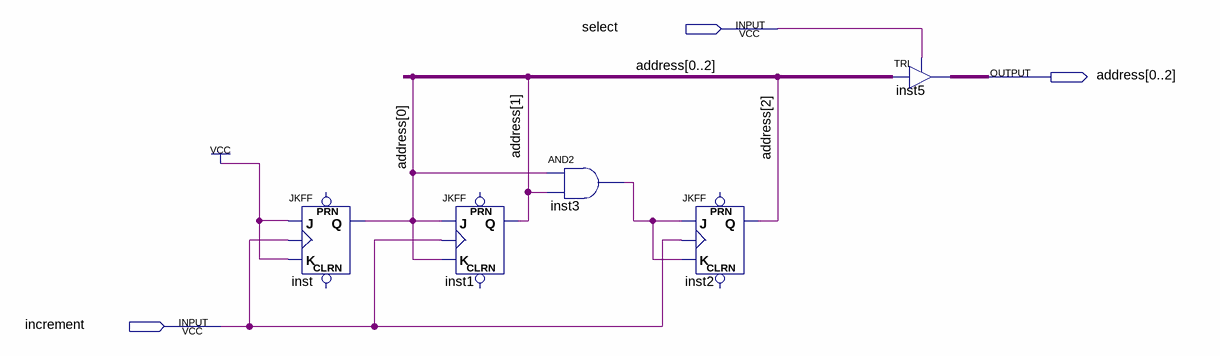
[diagram p0: schematic sheet]
// Quartus schematic instruction_pointer.bdf as structural Verilog: 5 symbols, 3 pins
module instruction_pointer (
  input  select,
  input  increment,
  output [0:2] address
);

  wire inst3_out;

  JKFF inst (.K(1'b1), .J(1'b1), .CLK(increment), .Q(address[0]));  // open: PRN, CLRN
  JKFF inst1 (.K(address[0]), .J(address[0]), .CLK(increment), .Q(address[1]));  // open: PRN, CLRN
  and inst3 (inst3_out, address[0], address[1]);
  JKFF inst2 (.K(inst3_out), .J(inst3_out), .CLK(increment), .Q(address[2]));  // open: PRN, CLRN
  TRI inst5[2:0] (.IN(address), .OE(select), .OUT(address));
endmodule
